# EAGLE board ellipticlock-display-r3 (EAGLE 5.12)
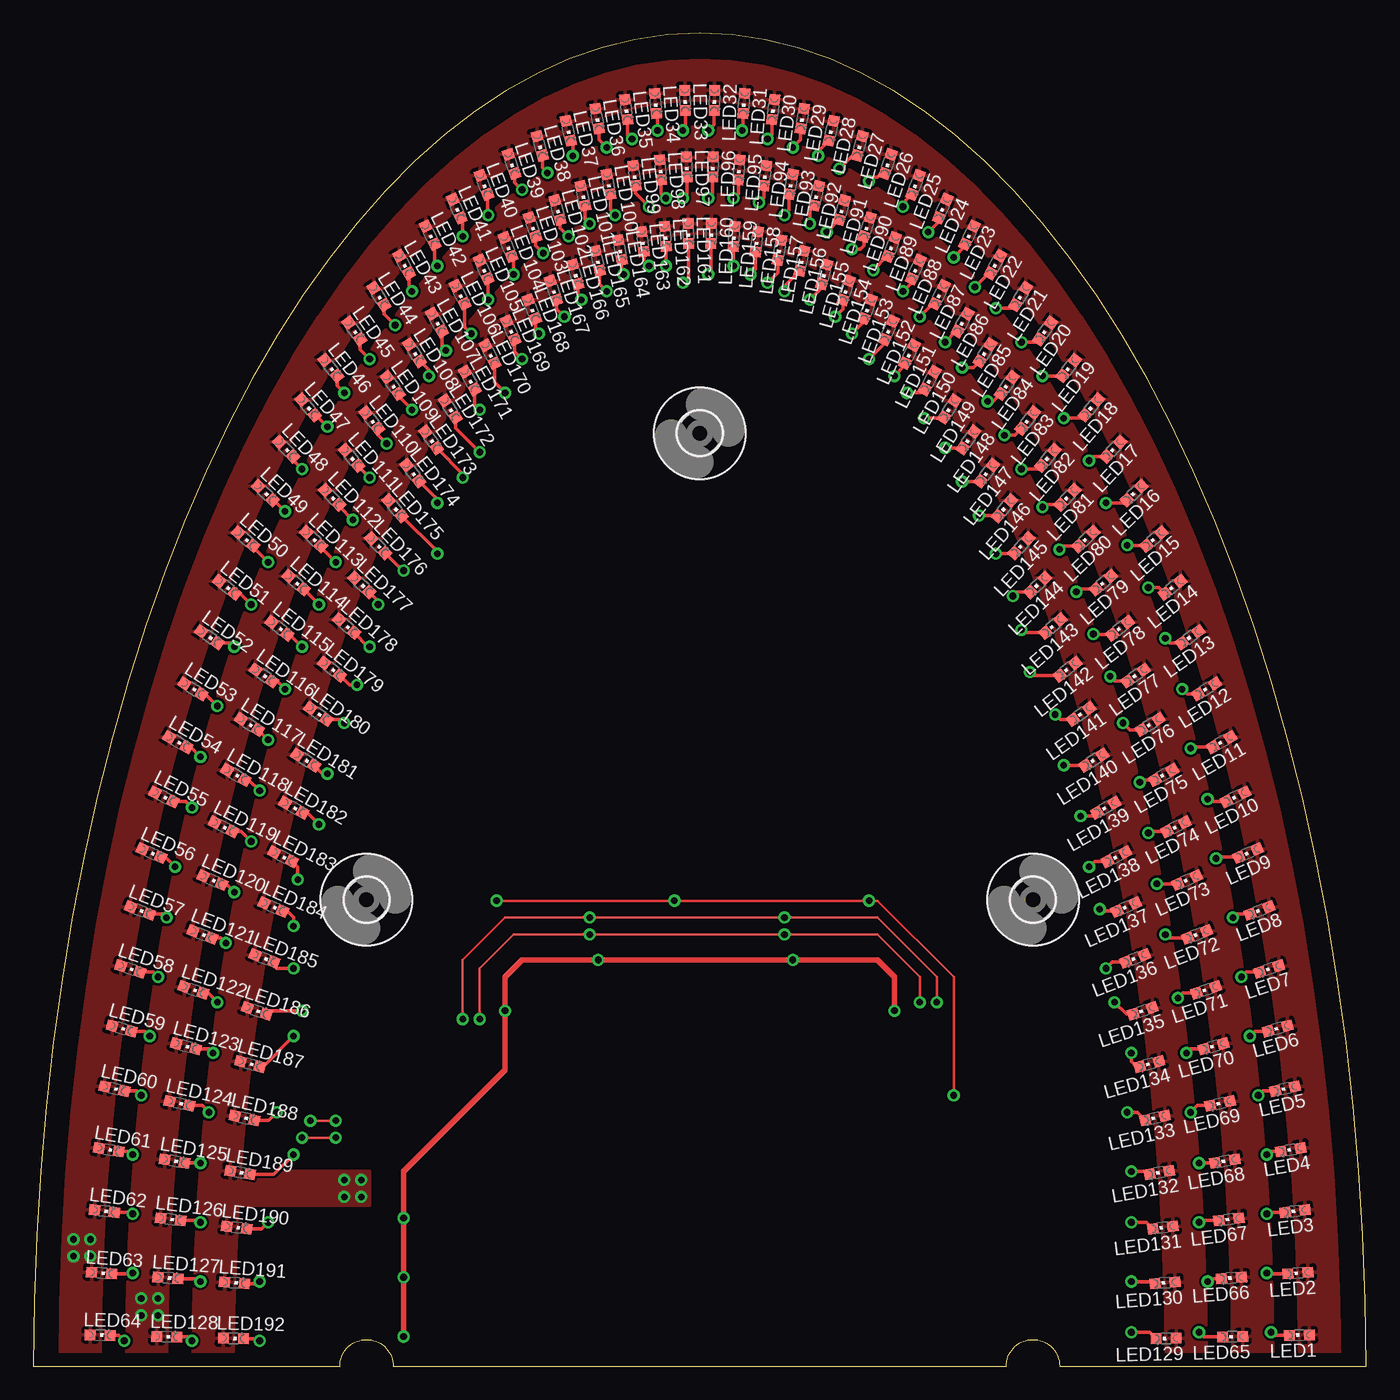
[diagram p5: board, top side]
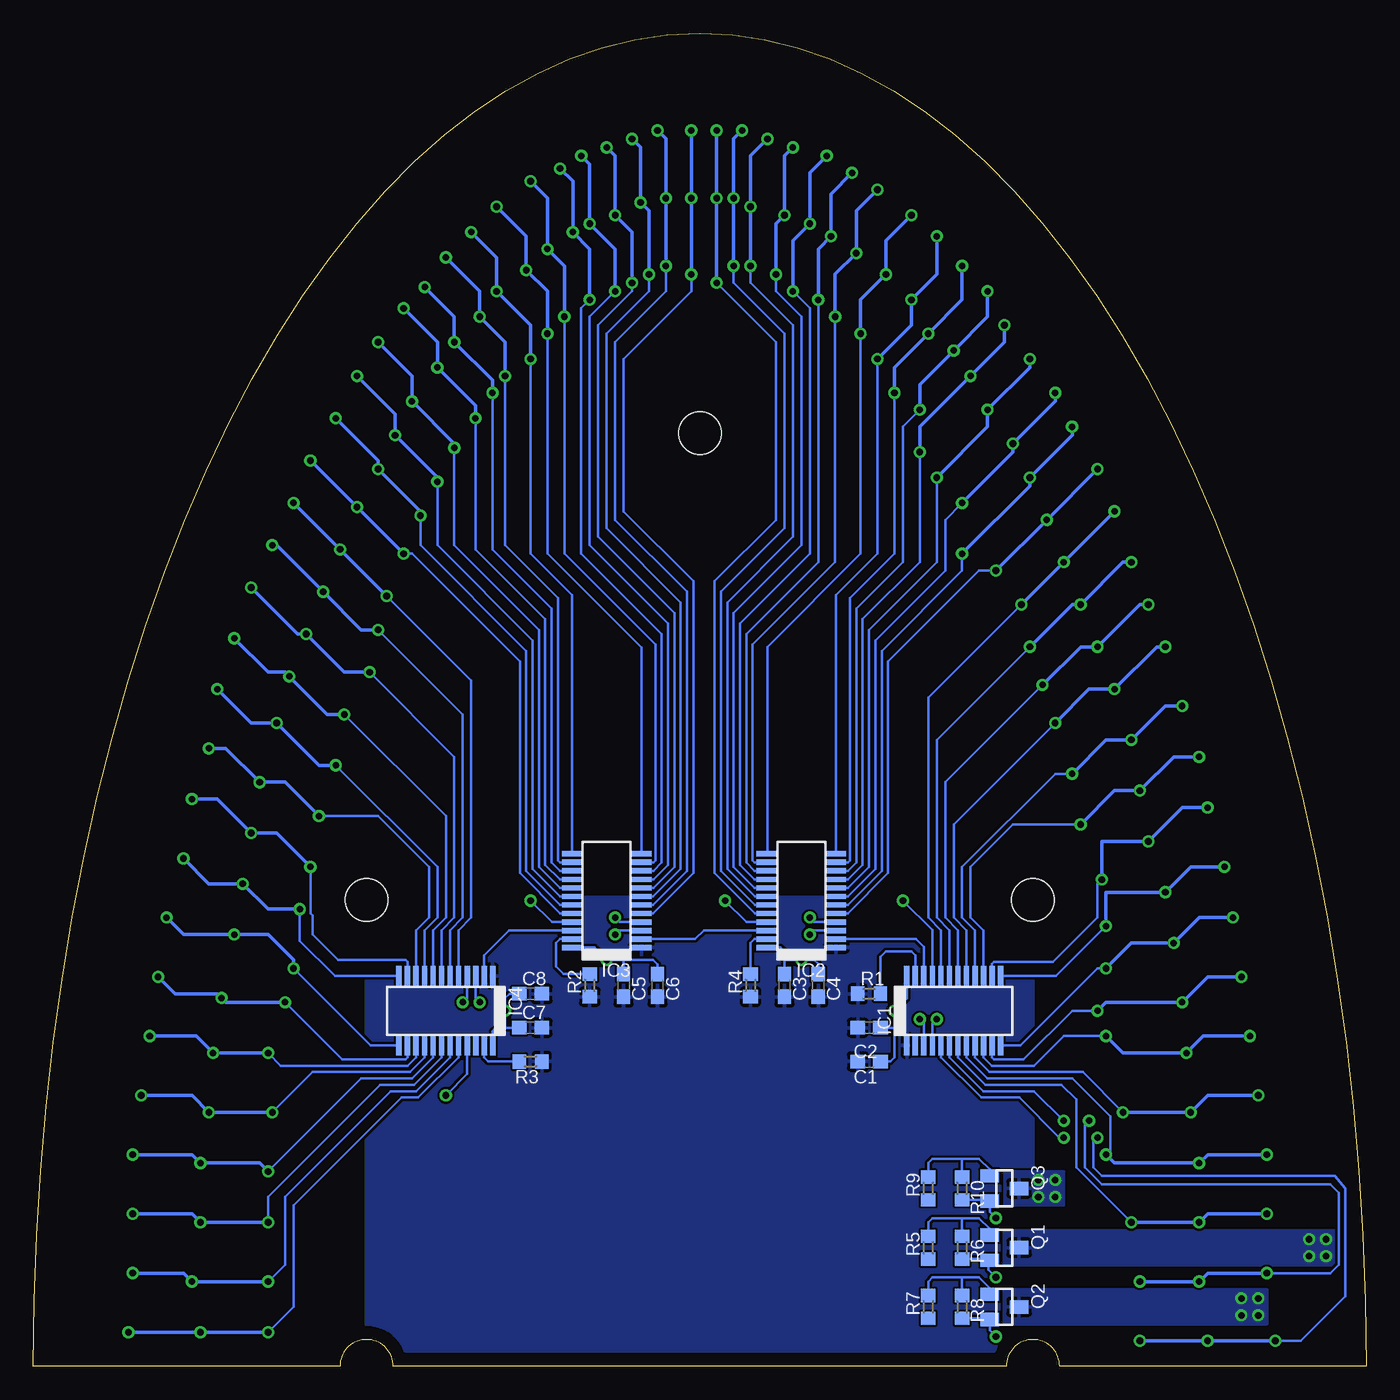
[diagram p6: board, bottom side, seen from below]

Size 100 x 100 mm. Coordinates in mm from the lower left corner, seen from the top.
Outline: 0,0 23,0 arc-90 25,2 arc-90 27,0 73,0 arc-90 75,2 arc-90 77,0 100,0 99.94,4.91 99.76,9.8 99.46,14.67 99.04,19.51 98.5,24.3 97.85,29.03 97.08,33.69 96.19,38.27 95.2,42.76 94.1,47.14 92.89,51.41 91.57,55.56 90.16,59.57 88.65,63.44 87.05,67.16 85.35,70.71 83.58,74.09 81.72,77.3 79.78,80.32 77.78,83.15 75.7,85.77 73.57,88.19 71.38,90.4 69.13,92.39 66.84,94.15 64.51,95.69 62.15,97 59.76,98.08 57.34,98.92 54.9,99.52 52.45,99.88 50,100 47.55,99.88 45.1,99.52 42.66,98.92 40.24,98.08 37.85,97 35.49,95.69 33.16,94.15 30.87,92.39 28.62,90.4 26.43,88.19 24.3,85.77 22.22,83.15 20.21,80.32 18.28,77.3 16.42,74.09 14.65,70.71 12.95,67.16 11.35,63.44 9.84,59.57 8.43,55.56 7.11,51.41 5.9,47.14 4.8,42.76 3.81,38.27 2.92,33.69 2.15,29.03 1.5,24.3 0.96,19.51 0.54,14.67 0.24,9.8 0.06,4.91 0,0
Copper layers (1*16): Top 0.035mm / dielectric 1.5mm / Bottom 0.035mm
Design rules "default *": minimum track width 6mil, minimum drill 0.5mm, track to track 7mil, track to pad 7mil, pad to pad 7mil, via to via 7mil, smd to smd 7mil, copper to edge 40mil, drill to drill 8mil, minimum pad ring 10mil, minimum via ring 8mil, stop-mask expansion 4mil, vias tented up to drill 20mil, thermal gap 10mil

## Footprints (pad centres in the part's own frame; a part is rotated, then mirrored left to right if it is on the bottom)
C0603 = smd 1.1 x 1: 1 -0.85,0; 2 0.85,0
3,2 = hole 3.2: 0,0
SSOP24-0.64 = smd 0.4 x 1.5: 1 -3.52,-2.6; 2 -2.88,-2.6; 3 -2.24,-2.6; 4 -1.6,-2.6; 5 -0.96,-2.6; 6 -0.32,-2.6; 7 0.32,-2.6; 8 0.96,-2.6; 9 1.6,-2.6; 10 2.24,-2.6; 11 2.88,-2.6; 12 3.52,-2.6; 13 3.52,2.6; 14 2.88,2.6; 15 2.24,2.6; 16 1.6,2.6; 17 0.96,2.6; 18 0.32,2.6; 19 -0.32,2.6; 20 -0.96,2.6; 21 -1.6,2.6; 22 -2.24,2.6; 23 -2.88,2.6; 24 -3.52,2.6
CHIPLED_0603 = smd 0.8 x 0.8: A 0,-0.75; C 0,0.75
SUPER-SOT3 = smd 1 x 1.4: 1 -0.95,-1.1; 2 0.95,-1.1; 3 0,1.1
R0603 = smd 1 x 1.1: 1 -0.85,0; 2 0.85,0

## Placement (x,y rotation side)
C1  100n  [C0603]  37.3,22.86 180 bottom
C2  1u  [C0603]  37.3,25.4 180 bottom
C3  100n  [C0603]  43.65,28.57 270 bottom
C4  1u  [C0603]  41.11,28.57 270 bottom
C5  100n  [C0603]  55.72,28.57 270 bottom
C6  1u  [C0603]  53.17,28.57 270 bottom
C7  100n  [C0603]  62.7,25.4 0 bottom
C8  1u  [C0603]  62.7,27.94 0 bottom
H1  MOUNT-HOLE3.2  [3,2]  25,35 0 top
H2  MOUNT-HOLE3.2  [3,2]  50,70 0 top
H3  MOUNT-HOLE3.2  [3,2]  75,35 0 top
IC1  TC62D748CFNAG  [SSOP24-0.64]  30.95,26.67 0 bottom
IC2  TC62D748CFNAG  [SSOP24-0.64]  42.38,34.92 90 bottom
IC3  TC62D748CFNAG  [SSOP24-0.64]  56.98,34.92 90 bottom
IC4  TC62D748CFNAG  [SSOP24-0.64]  69.05,26.67 180 bottom
LED1  [CHIPLED_0603]  94.99,2.33 91.4 top
LED2  [CHIPLED_0603]  94.88,6.99 94.2 top
LED3  [CHIPLED_0603]  94.66,11.63 97 top
LED4  [CHIPLED_0603]  94.34,16.24 99.8 top
LED5  [CHIPLED_0603]  93.91,20.81 102.7 top
LED6  [CHIPLED_0603]  93.37,25.34 105.5 top
LED7  [CHIPLED_0603]  92.73,29.8 108.3 top
LED8  [CHIPLED_0603]  91.98,34.19 111.1 top
LED9  [CHIPLED_0603]  91.14,38.5 113.9 top
LED10  [CHIPLED_0603]  90.2,42.71 116.7 top
LED11  [CHIPLED_0603]  89.15,46.83 119.5 top
LED12  [CHIPLED_0603]  88.02,50.82 122.3 top
LED13  [CHIPLED_0603]  86.79,54.7 125.2 top
LED14  [CHIPLED_0603]  85.48,58.45 128 top
LED15  [CHIPLED_0603]  84.07,62.05 130.8 top
LED16  [CHIPLED_0603]  82.59,65.51 133.6 top
LED17  [CHIPLED_0603]  81.03,68.8 136.4 top
LED18  [CHIPLED_0603]  79.39,71.93 139.2 top
LED19  [CHIPLED_0603]  77.69,74.89 142 top
LED20  [CHIPLED_0603]  75.91,77.67 144.8 top
LED21  [CHIPLED_0603]  74.07,80.26 147.7 top
LED22  [CHIPLED_0603]  72.18,82.66 150.5 top
LED23  [CHIPLED_0603]  70.23,84.86 153.3 top
LED24  [CHIPLED_0603]  68.24,86.85 156.1 top
LED25  [CHIPLED_0603]  66.2,88.63 158.9 top
LED26  [CHIPLED_0603]  64.12,90.21 161.7 top
LED27  [CHIPLED_0603]  62,91.56 164.5 top
LED28  [CHIPLED_0603]  59.86,92.69 167.3 top
LED29  [CHIPLED_0603]  57.69,93.6 170.2 top
LED30  [CHIPLED_0603]  55.51,94.29 173 top
LED31  [CHIPLED_0603]  53.31,94.74 175.8 top
LED32  [CHIPLED_0603]  51.1,94.97 178.6 top
LED33  [CHIPLED_0603]  48.9,94.97 181.4 top
LED34  [CHIPLED_0603]  46.69,94.74 184.2 top
LED35  [CHIPLED_0603]  44.49,94.29 187 top
LED36  [CHIPLED_0603]  42.31,93.6 189.8 top
LED37  [CHIPLED_0603]  40.14,92.69 192.7 top
LED38  [CHIPLED_0603]  38,91.56 195.5 top
LED39  [CHIPLED_0603]  35.88,90.21 198.3 top
LED40  [CHIPLED_0603]  33.8,88.63 201.1 top
LED41  [CHIPLED_0603]  31.76,86.85 203.9 top
LED42  [CHIPLED_0603]  29.77,84.86 206.7 top
LED43  [CHIPLED_0603]  27.82,82.66 209.5 top
LED44  [CHIPLED_0603]  25.93,80.26 212.3 top
LED45  [CHIPLED_0603]  24.09,77.67 215.2 top
LED46  [CHIPLED_0603]  22.31,74.89 218 top
LED47  [CHIPLED_0603]  20.61,71.93 220.8 top
LED48  [CHIPLED_0603]  18.97,68.8 223.6 top
LED49  [CHIPLED_0603]  17.41,65.51 226.4 top
LED50  [CHIPLED_0603]  15.93,62.05 229.2 top
LED51  [CHIPLED_0603]  14.52,58.45 232 top
LED52  [CHIPLED_0603]  13.21,54.7 234.8 top
LED53  [CHIPLED_0603]  11.98,50.82 237.7 top
LED54  [CHIPLED_0603]  10.85,46.83 240.5 top
LED55  [CHIPLED_0603]  9.8,42.71 243.3 top
LED56  [CHIPLED_0603]  8.86,38.5 246.1 top
LED57  [CHIPLED_0603]  8.02,34.19 248.9 top
LED58  [CHIPLED_0603]  7.27,29.8 251.7 top
LED59  [CHIPLED_0603]  6.63,25.34 254.5 top
LED60  [CHIPLED_0603]  6.09,20.81 257.3 top
LED61  [CHIPLED_0603]  5.66,16.24 260.2 top
LED62  [CHIPLED_0603]  5.34,11.63 263 top
LED63  [CHIPLED_0603]  5.12,6.99 265.8 top
LED64  [CHIPLED_0603]  5.01,2.33 268.6 top
LED65  [CHIPLED_0603]  89.99,2.21 91.4 top
LED66  [CHIPLED_0603]  89.89,6.62 94.2 top
LED67  [CHIPLED_0603]  89.7,11.02 97 top
LED68  [CHIPLED_0603]  89.41,15.39 99.8 top
LED69  [CHIPLED_0603]  89.03,19.72 102.7 top
LED70  [CHIPLED_0603]  88.55,24 105.5 top
LED71  [CHIPLED_0603]  87.98,28.23 108.3 top
LED72  [CHIPLED_0603]  87.32,32.39 111.1 top
LED73  [CHIPLED_0603]  86.57,36.47 113.9 top
LED74  [CHIPLED_0603]  85.73,40.47 116.7 top
LED75  [CHIPLED_0603]  84.8,44.36 119.5 top
LED76  [CHIPLED_0603]  83.79,48.15 122.3 top
LED77  [CHIPLED_0603]  82.7,51.82 125.2 top
LED78  [CHIPLED_0603]  81.53,55.37 128 top
LED79  [CHIPLED_0603]  80.29,58.79 130.8 top
LED80  [CHIPLED_0603]  78.97,62.06 133.6 top
LED81  [CHIPLED_0603]  77.58,65.18 136.4 top
LED82  [CHIPLED_0603]  76.13,68.15 139.2 top
LED83  [CHIPLED_0603]  74.61,70.95 142 top
LED84  [CHIPLED_0603]  73.03,73.58 144.8 top
LED85  [CHIPLED_0603]  71.4,76.04 147.7 top
LED86  [CHIPLED_0603]  69.72,78.31 150.5 top
LED87  [CHIPLED_0603]  67.98,80.39 153.3 top
LED88  [CHIPLED_0603]  66.21,82.28 156.1 top
LED89  [CHIPLED_0603]  64.4,83.97 158.9 top
LED90  [CHIPLED_0603]  62.55,85.46 161.7 top
LED91  [CHIPLED_0603]  60.67,86.74 164.5 top
LED92  [CHIPLED_0603]  58.76,87.81 167.3 top
LED93  [CHIPLED_0603]  56.84,88.67 170.2 top
LED94  [CHIPLED_0603]  54.9,89.32 173 top
LED95  [CHIPLED_0603]  52.94,89.76 175.8 top
LED96  [CHIPLED_0603]  50.98,89.97 178.6 top
LED97  [CHIPLED_0603]  49.02,89.97 181.4 top
LED98  [CHIPLED_0603]  47.06,89.76 184.2 top
LED99  [CHIPLED_0603]  45.1,89.32 187 top
LED100  [CHIPLED_0603]  43.16,88.67 189.8 top
LED101  [CHIPLED_0603]  41.24,87.81 192.7 top
LED102  [CHIPLED_0603]  39.33,86.74 195.5 top
LED103  [CHIPLED_0603]  37.45,85.46 198.3 top
LED104  [CHIPLED_0603]  35.6,83.97 201.1 top
LED105  [CHIPLED_0603]  33.79,82.28 203.9 top
LED106  [CHIPLED_0603]  32.02,80.39 206.7 top
LED107  [CHIPLED_0603]  30.28,78.31 209.5 top
LED108  [CHIPLED_0603]  28.6,76.04 212.3 top
LED109  [CHIPLED_0603]  26.97,73.58 215.2 top
LED110  [CHIPLED_0603]  25.39,70.95 218 top
LED111  [CHIPLED_0603]  23.87,68.15 220.8 top
LED112  [CHIPLED_0603]  22.42,65.18 223.6 top
LED113  [CHIPLED_0603]  21.03,62.06 226.4 top
LED114  [CHIPLED_0603]  19.71,58.79 229.2 top
LED115  [CHIPLED_0603]  18.47,55.37 232 top
LED116  [CHIPLED_0603]  17.3,51.82 234.8 top
LED117  [CHIPLED_0603]  16.21,48.15 237.7 top
LED118  [CHIPLED_0603]  15.2,44.36 240.5 top
LED119  [CHIPLED_0603]  14.27,40.47 243.3 top
LED120  [CHIPLED_0603]  13.43,36.47 246.1 top
LED121  [CHIPLED_0603]  12.68,32.39 248.9 top
LED122  [CHIPLED_0603]  12.02,28.23 251.7 top
LED123  [CHIPLED_0603]  11.45,24 254.5 top
LED124  [CHIPLED_0603]  10.97,19.72 257.3 top
LED125  [CHIPLED_0603]  10.59,15.39 260.2 top
LED126  [CHIPLED_0603]  10.3,11.02 263 top
LED127  [CHIPLED_0603]  10.11,6.62 265.8 top
LED128  [CHIPLED_0603]  10.01,2.21 268.6 top
LED129  [CHIPLED_0603]  84.99,2.09 91.4 top
LED130  [CHIPLED_0603]  84.91,6.25 94.2 top
LED131  [CHIPLED_0603]  84.74,10.4 97 top
LED132  [CHIPLED_0603]  84.48,14.53 99.8 top
LED133  [CHIPLED_0603]  84.15,18.62 102.7 top
LED134  [CHIPLED_0603]  83.73,22.67 105.5 top
LED135  [CHIPLED_0603]  83.23,26.66 108.3 top
LED136  [CHIPLED_0603]  82.65,30.59 111.1 top
LED137  [CHIPLED_0603]  82,34.45 113.9 top
LED138  [CHIPLED_0603]  81.26,38.22 116.7 top
LED139  [CHIPLED_0603]  80.45,41.9 119.5 top
LED140  [CHIPLED_0603]  79.57,45.47 122.3 top
LED141  [CHIPLED_0603]  78.62,48.94 125.2 top
LED142  [CHIPLED_0603]  77.59,52.29 128 top
LED143  [CHIPLED_0603]  76.5,55.52 130.8 top
LED144  [CHIPLED_0603]  75.35,58.61 133.6 top
LED145  [CHIPLED_0603]  74.13,61.56 136.4 top
LED146  [CHIPLED_0603]  72.86,64.36 139.2 top
LED147  [CHIPLED_0603]  71.53,67.01 142 top
LED148  [CHIPLED_0603]  70.15,69.49 144.8 top
LED149  [CHIPLED_0603]  68.72,71.81 147.7 top
LED150  [CHIPLED_0603]  67.25,73.96 150.5 top
LED151  [CHIPLED_0603]  65.74,75.92 153.3 top
LED152  [CHIPLED_0603]  64.18,77.71 156.1 top
LED153  [CHIPLED_0603]  62.6,79.3 158.9 top
LED154  [CHIPLED_0603]  60.98,80.71 161.7 top
LED155  [CHIPLED_0603]  59.33,81.92 164.5 top
LED156  [CHIPLED_0603]  57.67,82.93 167.3 top
LED157  [CHIPLED_0603]  55.98,83.75 170.2 top
LED158  [CHIPLED_0603]  54.28,84.36 173 top
LED159  [CHIPLED_0603]  52.57,84.77 175.8 top
LED160  [CHIPLED_0603]  50.86,84.97 178.6 top
LED161  [CHIPLED_0603]  49.14,84.97 181.4 top
LED162  [CHIPLED_0603]  47.43,84.77 184.2 top
LED163  [CHIPLED_0603]  45.72,84.36 187 top
LED164  [CHIPLED_0603]  44.02,83.75 189.8 top
LED165  [CHIPLED_0603]  42.33,82.93 192.7 top
LED166  [CHIPLED_0603]  40.67,81.92 195.5 top
LED167  [CHIPLED_0603]  39.02,80.71 198.3 top
LED168  [CHIPLED_0603]  37.4,79.3 201.1 top
LED169  [CHIPLED_0603]  35.82,77.71 203.9 top
LED170  [CHIPLED_0603]  34.26,75.92 206.7 top
LED171  [CHIPLED_0603]  32.75,73.96 209.5 top
LED172  [CHIPLED_0603]  31.28,71.81 212.3 top
LED173  [CHIPLED_0603]  29.85,69.49 215.2 top
LED174  [CHIPLED_0603]  28.47,67.01 218 top
LED175  [CHIPLED_0603]  27.14,64.36 220.8 top
LED176  [CHIPLED_0603]  25.87,61.56 223.6 top
LED177  [CHIPLED_0603]  24.65,58.61 226.4 top
LED178  [CHIPLED_0603]  23.5,55.52 229.2 top
LED179  [CHIPLED_0603]  22.41,52.29 232 top
LED180  [CHIPLED_0603]  21.38,48.94 234.8 top
LED181  [CHIPLED_0603]  20.43,45.47 237.7 top
LED182  [CHIPLED_0603]  19.55,41.9 240.5 top
LED183  [CHIPLED_0603]  18.74,38.22 243.3 top
LED184  [CHIPLED_0603]  18,34.45 246.1 top
LED185  [CHIPLED_0603]  17.35,30.59 248.9 top
LED186  [CHIPLED_0603]  16.77,26.66 251.7 top
LED187  [CHIPLED_0603]  16.27,22.67 254.5 top
LED188  [CHIPLED_0603]  15.85,18.62 257.3 top
LED189  [CHIPLED_0603]  15.52,14.53 260.2 top
LED190  [CHIPLED_0603]  15.26,10.4 263 top
LED191  [CHIPLED_0603]  15.09,6.25 265.8 top
LED192  [CHIPLED_0603]  15.01,2.09 268.6 top
Q1  FDN360P  [SUPER-SOT3]  27.14,8.89 270 bottom
Q2  FDN360P  [SUPER-SOT3]  27.14,4.45 270 bottom
Q3  FDN360P  [SUPER-SOT3]  27.14,13.34 270 bottom
R1  [R0603]  37.3,27.94 0 bottom
R2  [R0603]  58.26,28.57 90 bottom
R3  [R0603]  62.7,22.86 180 bottom
R4  [R0603]  46.19,28.57 90 bottom
R5  1K  [R0603]  32.86,8.89 90 bottom
R6  10K  [R0603]  30.32,8.89 270 bottom
R7  1K  [R0603]  32.86,4.45 90 bottom
R8  10K  [R0603]  30.32,4.45 270 bottom
R9  1K  [R0603]  32.86,13.34 90 bottom
R10  10K  [R0603]  30.32,13.34 270 bottom

## Tracks (layer width: path | path; a pad name or v marks a point on that pad's centre or on a via)
+5V  (via drill 0.5)
  Top 0.406: v64.61,26.67 64.61,29.21 63.34,30.48 v56.98,30.48 v42.38,30.48 36.66,30.48 35.39,29.21 v35.39,26.67 35.39,22.23 27.77,14.61 v27.77,11.11 v27.77,6.67 v27.77,2.22
  Bottom 0.203: 35.39,25.4 35.39,23.18 35.71,22.86 C1.1 | 35.39,25.4 C2.1 | IC2.24 43.94,31.41 43.65,31.11 43.65,30.48 | 43.65,30.48 C3.1 | C4.1 41.11,30.16 41.43,30.48 v42.38,30.48 | v42.38,30.48 43.65,30.48 | 55.72,30.48 53.49,30.48 53.17,30.16 C6.1 | 55.72,30.48 C5.1 | IC4.24 65.53,25.11 65.24,25.4 64.61,25.4 | 64.61,25.4 C7.1 | C8.1 64.29,27.94 64.61,27.62 v64.61,26.67 64.61,25.4 | IC3.24 57.91,31.41 v56.98,30.48 55.72,30.48 | v42.38,30.48 | 35.39,25.4 v35.39,26.67 34.47,27.59 IC1.24 | R10.2 28.34,12.48 Q3.2 28.24,11.58 v27.77,11.11 | 28.34,8.04 R6.2 | 28.34,8.04 Q1.2 | R8.2 28.34,3.6 Q2.2 28.24,2.69 v27.77,2.22 | 28.34,8.04 28.34,7.23 v27.77,6.67
GND
  pour Bottom (rank 6): 25,0 25,35.16 75,35.16 75,0
LAT  (via drill 0.5)
  Top 0.203: v67.78,27.3 67.78,29.21 63.34,33.66 v56.35,33.66 v41.74,33.66 35.39,33.66 32.22,30.48 v32.22,26.04
  Bottom 0.203: IC4.4 67.45,27.64 v67.78,27.3 | v56.35,33.66 56.02,33.33 IC3.4 | IC2.4 41.41,33.33 v41.74,33.66 | IC1.4 32.55,25.7 v32.22,26.04
N$1
  Bottom 0.203: IC2.2 33.78,32.05 33.19,31.45 IC1.22
N$6
  Bottom 0.203: IC4.2 66.17,30.82 64.31,32.69 IC3.22
N$7
  Bottom 0.203: IC3.2 50.34,32.05 49.7,32.69 IC2.22
N$8
  Bottom 0.203: IC2.23 45.89,32.05 46.19,31.75 R4.2
N$9
  Bottom 0.203: IC4.23 66.17,23.16 65.88,22.86 R3.2
N$10
  Bottom 0.203: IC1.23 33.83,30.82 34.12,31.11 36.03,31.11 36.45,30.7 R1.2
N$11
  Bottom 0.203: IC3.23 60.5,32.05 60.8,31.75 60.8,30 60.22,29.43 R2.2
N$12
  Bottom 0.203: 30.32,11.11 32.54,11.11 32.86,10.79 R5.2 | 30.32,11.11 R6.1 | Q1.1 28.24,10.31 29.05,11.11 30.32,11.11
N$28
  Bottom 0.203: 30.32,6.67 32.54,6.67 32.86,6.35 R7.2 | 30.32,6.67 R8.1 | Q2.1 28.24,5.86 29.05,6.67 30.32,6.67
N$29
  Bottom 0.203: 30.32,15.56 32.54,15.56 32.86,15.24 R9.2 | 30.32,15.56 R10.1 | Q3.1 28.24,14.75 29.05,15.56 30.32,15.56
OE  (via drill 0.5)
  Top 0.203: v34.76,34.92 v48.09,34.92 v62.7,34.92 63.34,34.92 69.05,29.21 v69.05,20.32
  Bottom 0.203: IC2.21 46.49,33.33 v48.09,34.92 | v34.76,34.92 32.55,32.72 IC1.21 | IC3.21 61.1,33.33 v62.7,34.92 | IC4.21 67.45,21.92 v69.05,20.32
RING1  (via drill 0.5)
  other vias: 3.01,9.53 4.28,9.53 4.28,8.26 3.01,8.26
  pour Top: 95,0 94.95,4.66 94.78,9.31 94.51,13.94 94.14,18.53 93.65,23.08 93.06,27.58 92.37,32 91.57,36.35 90.68,40.62 89.69,44.78 88.6,48.84 87.42,52.78 86.14,56.59 84.79,60.27 83.34,63.8 81.82,67.18 80.22,70.39 78.55,73.44 76.81,76.3 75,78.99 73.13,81.48 71.21,83.78 69.24,85.88 67.22,87.77 65.16,89.45 63.06,90.91 60.93,92.15 58.78,93.17 56.6,93.97 54.41,94.54 52.21,94.89 50,95 47.79,94.89 45.59,94.54 43.4,93.97 41.22,93.17 39.07,92.15 36.94,90.91 34.84,89.45 32.78,87.77 30.76,85.88 28.79,83.78 26.87,81.48 25,78.99 23.19,76.3 21.45,73.44 19.78,70.39 18.18,67.18 16.66,63.8 15.21,60.27 13.86,56.59 12.58,52.78 11.4,48.84 10.31,44.78 9.32,40.62 8.43,36.35 7.63,32 6.94,27.58 6.35,23.08 5.86,18.53 5.49,13.94 5.22,9.31 5.05,4.66 5,0 2,0 2.06,4.81 2.23,9.61 2.52,14.38 2.92,19.12 3.44,23.81 4.07,28.45 4.81,33.02 5.65,37.5 6.61,41.9 7.67,46.2 8.83,50.38 10.09,54.45 11.45,58.38 12.9,62.17 14.43,65.81 16.06,69.3 17.77,72.61 19.55,75.75 21.41,78.71 23.33,81.48 25.32,84.06 27.37,86.43 29.48,88.59 31.63,90.54 33.83,92.27 36.07,93.78 38.34,95.06 40.64,96.12 42.96,96.94 45.3,97.53 47.64,97.88 50,98 52.36,97.88 54.7,97.53 57.04,96.94 59.36,96.12 61.66,95.06 63.93,93.78 66.17,92.27 68.37,90.54 70.52,88.59 72.63,86.43 74.68,84.06 76.67,81.48 78.59,78.71 80.45,75.75 82.23,72.61 83.94,69.3 85.57,65.81 87.1,62.17 88.55,58.38 89.91,54.45 91.17,50.38 92.33,46.2 93.39,41.9 94.35,37.5 95.19,33.02 95.93,28.45 96.56,23.81 97.08,19.12 97.48,14.38 97.77,9.61 97.94,4.81 98,0
  pour Bottom: 27.14,7.62 27.14,10.16 2.38,10.16 2.38,7.62
RING2  (via drill 0.5)
  other vias: 8.09,5.08 9.36,5.08 9.36,3.81 8.09,3.81
  pour Top: 90,0 89.95,4.42 89.81,8.82 89.57,13.21 89.23,17.56 88.8,21.87 88.28,26.13 87.66,30.32 86.96,34.44 86.16,38.48 85.28,42.43 84.31,46.27 83.26,50 82.13,53.61 80.92,57.1 79.64,60.44 78.28,63.64 76.86,66.69 75.38,69.57 73.83,72.29 72.22,74.83 70.56,77.2 68.86,79.37 67.1,81.36 65.31,83.15 63.48,84.74 61.61,86.12 59.72,87.3 57.8,88.27 55.87,89.03 53.92,89.57 51.96,89.89 50,90 48.04,89.89 46.08,89.57 44.13,89.03 42.2,88.27 40.28,87.3 38.39,86.12 36.52,84.74 34.69,83.15 32.9,81.36 31.14,79.37 29.44,77.2 27.78,74.83 26.17,72.29 24.62,69.57 23.14,66.69 21.72,63.64 20.36,60.44 19.08,57.1 17.87,53.61 16.74,50 15.69,46.27 14.72,42.43 13.84,38.48 13.04,34.44 12.34,30.32 11.72,26.13 11.2,21.87 10.77,17.56 10.43,13.21 10.19,8.82 10.05,4.42 10,0 7,0 7.05,4.56 7.21,9.12 7.47,13.65 7.83,18.14 8.29,22.6 8.85,27 9.51,31.33 10.27,35.59 11.13,39.76 12.08,43.84 13.12,47.81 14.25,51.67 15.46,55.4 16.76,59 18.14,62.45 19.59,65.76 21.12,68.91 22.72,71.89 24.38,74.7 26.11,77.33 27.89,79.77 29.73,82.02 31.62,84.07 33.54,85.92 35.51,87.56 37.52,89 39.55,90.21 41.61,91.21 43.69,91.99 45.79,92.55 47.89,92.89 50,93 52.11,92.89 54.21,92.55 56.31,91.99 58.39,91.21 60.45,90.21 62.48,89 64.49,87.56 66.46,85.92 68.38,84.07 70.27,82.02 72.11,79.77 73.89,77.33 75.62,74.7 77.28,71.89 78.88,68.91 80.41,65.76 81.86,62.45 83.24,59 84.54,55.4 85.75,51.67 86.88,47.81 87.92,43.84 88.87,39.76 89.73,35.59 90.49,31.33 91.15,27 91.71,22.6 92.17,18.14 92.53,13.65 92.79,9.12 92.95,4.56 93,0
  pour Bottom: 7.45,3.17 27.14,3.17 27.14,5.71 7.45,5.71
RING3  (via drill 0.5)
  other vias: 23.33,13.97 23.33,12.7 24.6,12.7 24.6,13.97
  pour Top: 85,0 84.96,4.17 84.83,8.33 84.62,12.47 84.33,16.58 83.95,20.65 83.49,24.67 82.95,28.64 82.34,32.53 81.64,36.34 80.87,40.07 80.02,43.7 79.1,47.22 78.11,50.63 77.06,53.92 75.93,57.08 74.75,60.1 73.5,62.98 72.2,65.71 70.85,68.27 69.44,70.67 67.99,72.91 66.5,74.96 64.96,76.84 63.39,78.53 61.79,80.03 60.16,81.34 58.5,82.45 56.83,83.37 55.14,84.08 53.43,84.59 51.72,84.9 50,85 48.28,84.9 46.57,84.59 44.86,84.08 43.17,83.37 41.5,82.45 39.84,81.34 38.21,80.03 36.61,78.53 35.04,76.84 33.5,74.96 32.01,72.91 30.55,70.67 29.15,68.27 27.8,65.71 26.5,62.98 25.25,60.1 24.07,57.08 22.94,53.92 21.89,50.63 20.9,47.22 19.98,43.7 19.13,40.07 18.36,36.34 17.66,32.53 17.05,28.64 16.51,24.67 16.05,20.65 15.67,16.58 15.38,12.47 15.17,8.33 15.04,4.17 15,0 12,0 12.05,4.32 12.18,8.63 12.41,12.91 12.73,17.17 13.14,21.38 13.64,25.55 14.22,29.65 14.89,33.68 15.65,37.62 16.49,41.48 17.41,45.24 18.4,48.89 19.48,52.42 20.63,55.83 21.84,59.1 23.13,62.23 24.48,65.2 25.89,68.02 27.36,70.68 28.89,73.17 30.46,75.48 32.09,77.61 33.75,79.55 35.46,81.3 37.2,82.86 38.97,84.21 40.77,85.36 42.59,86.31 44.42,87.05 46.28,87.58 48.14,87.89 50,88 51.86,87.89 53.72,87.58 55.58,87.05 57.41,86.31 59.23,85.36 61.03,84.21 62.8,82.86 64.54,81.3 66.25,79.55 67.91,77.61 69.54,75.48 71.11,73.17 72.64,70.68 74.11,68.02 75.52,65.2 76.87,62.23 78.16,59.1 79.37,55.83 80.52,52.42 81.6,48.89 82.59,45.24 83.51,41.48 84.35,37.62 85.11,33.68 85.78,29.65 86.36,25.55 86.86,21.38 87.27,17.17 87.59,12.91 87.82,8.63 87.95,4.32 88,0
  pour Top: 25.23,12.06 25.23,14.61 15.08,14.61 15.08,12.06
  pour Bottom: 27.14,14.61 27.14,12.06 22.7,12.06 22.7,14.61
SCK  (via drill 0.5)
  Top 0.203: v33.49,26.04 33.49,29.84 36.03,32.38 v41.74,32.38 v56.35,32.38 63.34,32.38 66.51,29.21 v66.51,27.3
  Bottom 0.203: IC1.3 33.19,25.73 v33.49,26.04 | v56.35,32.38 56.05,32.69 IC3.3 | IC2.3 41.45,32.69 v41.74,32.38 | IC4.3 66.81,27.61 v66.51,27.3
SPOKE1  (via drill 0.5)
  Top 0.254: v82.38,2.54 83.77,2.54 LED129.C | LED1.C 93.09,2.31 v92.86,2.54 | LED65.C 87.81,2.19 v87.47,2.54
  Bottom 0.203: IC4.20 68.09,23.18 71.11,20.16 72.38,20.16 80.48,12.06 80.48,4.45 v82.38,2.54
  Bottom 0.254: v82.38,2.54 v87.47,2.54 v92.86,2.54
SPOKE2  (via drill 0.5)
  Top 0.254: v82.38,6.35 84,6.35 LED130.C | LED66.C 88.32,6.57 v88.1,6.35 | LED2.C 92.6,6.93 v92.55,6.99
  Bottom 0.203: IC4.19 68.73,23.18 71.27,20.64 73.18,20.64 81.11,12.7 81.11,7.62 v82.38,6.35
  Bottom 0.254: v82.38,6.35 v88.1,6.35 88.73,6.99 v92.55,6.99
SPOKE3  (via drill 0.5)
  Top 0.254: v82.38,10.79 83.51,10.79 LED131.C | LED67.C 87.6,10.93 v87.47,10.79 | LED3.C 92.65,11.54 v92.55,11.43
  Bottom 0.203: IC4.18 69.37,23.18 71.43,21.11 73.97,21.11 82.38,12.7 v82.38,10.79
  Bottom 0.254: v82.38,10.79 v87.47,10.79 88.1,11.43 v92.55,11.43
SPOKE4  (via drill 0.5)
  Top 0.254: v82.38,14.61 83.55,14.61 LED132.C | LED4.C 92.78,16.11 v92.55,15.88 | LED68.C 87.48,15.26 v87.47,15.24
  Bottom 0.203: IC4.17 70.01,23.17 71.59,21.59 75.4,21.59 v82.38,14.61
  Bottom 0.254: v92.55,15.88 88.1,15.88 v87.47,15.24 83.02,15.24 v82.38,14.61
SPOKE5  (via drill 0.5)
  Top 0.254: v82.07,19.05 82.83,19.05 LED133.C | LED69.C 87.33,19.55 v86.83,19.05 | LED5.C 92.24,20.65 v91.91,20.32
  Bottom 0.203: IC4.16 70.65,23.16 71.75,22.07 79.05,22.07 v82.07,19.05
  Bottom 0.254: v82.07,19.05 v86.83,19.05 88.1,20.32 v91.91,20.32
SPOKE6  (via drill 0.5)
  Top 0.254: LED6.C 91.65,25.14 v91.28,24.77 | LED70.C 86.82,23.8 v86.51,23.5 | LED134.C 82.78,22.47 82.38,22.86 v82.38,23.5
  Bottom 0.203: IC4.15 71.29,23.16 71.91,22.54 81.43,22.54 v82.38,23.5
  Bottom 0.254: v91.28,24.77 87.78,24.77 v86.51,23.5 v82.38,23.5
SPOKE7  (via drill 0.5)
  Top 0.254: LED7.C 90.99,29.56 v90.64,29.21 | LED71.C 86.25,28 v85.88,27.62 | LED135.C 81.99,26.43 v81.11,27.3
  Bottom 0.203: IC4.14 71.93,23.16 72.07,23.02 76.83,23.02 v81.11,27.3
  Bottom 0.254: v81.11,27.3 85.56,27.3 v85.88,27.62 86.19,27.94 89.37,27.94 v90.64,29.21
SPOKE8  (via drill 0.5)
  Top 0.254: LED8.C 90.27,33.92 v90,33.66 | LED72.C 85.19,32.12 v84.92,32.38 | LED136.C 80.96,30.32 v80.48,29.84
  Bottom 0.203: IC4.13 74.7,24.07 v80.48,29.84
  Bottom 0.254: v90,33.66 88.73,32.38 v84.92,32.38 82.38,32.38 80.48,30.48 v80.48,29.84
SPOKE9  (via drill 0.5)
  Top 0.254: LED9.C 88.83,38.19 v88.73,38.1 | LED137.C 80.15,34.14 v80,34.29 | LED73.C 84.32,36.17 v84.29,36.2
  Bottom 0.203: IC4.12 77.36,29.27 80,31.91 v80,34.29
  Bottom 0.254: v80,34.29 82.38,34.29 v84.29,36.2 86.83,36.2 v88.73,38.1
SPOKE10  (via drill 0.5)
  Top 0.254: LED74.C 83.78,40.13 v83.66,40.01 | LED10.C 88.27,42.38 v88.1,42.55 | LED138.C 79.62,37.88 v79.21,37.47
  Bottom 0.203: IC4.11 71.93,30.34 72.07,30.48 77.15,30.48 79.05,32.38 79.05,33.81 79.21,33.97 v79.21,37.47
  Bottom 0.254: v79.21,37.47 81.75,40.01 v83.66,40.01 86.19,42.55 v88.1,42.55
SPOKE11  (via drill 0.5)
  Top 0.254: v78.58,41.27 79.55,41.27 LED139.C | LED75.C 83.2,43.99 v83.02,43.81 | LED11.C 86.93,46.46 v86.83,46.35
  Bottom 0.203: IC4.10 71.29,32.69 70.32,33.66 70.32,37.47 74.13,41.27 v78.58,41.27
  Bottom 0.254: v78.58,41.27 81.11,43.81 v83.02,43.81 85.56,46.35 v86.83,46.35
SPOKE12  (via drill 0.5)
  Top 0.254: LED12.C 86.57,50.42 v86.19,50.8 | LED140.C 77.32,45.07 v77.31,45.09 | LED76.C 82.26,47.75 v81.75,48.26
  Bottom 0.203: IC4.9 70.65,32.69 69.69,33.66 69.69,37.47 v77.31,45.09
  Bottom 0.254: v77.31,45.09 78.58,45.09 v81.75,48.26 83.66,48.26 v86.19,50.8
SPOKE13  (via drill 0.5)
  Top 0.254: LED13.C 85.27,54.27 v84.92,54.61 | LED77.C 81.16,51.39 v80.8,51.75 | LED141.C 77.05,48.51 v76.67,48.9
  Bottom 0.203: IC4.8 70.01,32.7 69.05,33.66 69.05,41.27 v76.67,48.9
  Bottom 0.254: v76.67,48.9 77.94,48.9 v80.8,51.75 81.11,52.07 82.38,52.07 v84.92,54.61
SPOKE14  (via drill 0.5)
  Top 0.254: v83.66,58.42 84.45,58.42 LED14.C | LED142.C 75,51.83 v74.77,52.07 | LED78.C 79.55,54.91 v79.53,54.93
  Bottom 0.203: IC4.7 69.37,32.7 68.41,33.66 68.41,45.72 v74.77,52.07
  Bottom 0.254: v74.77,52.07 76.67,52.07 v79.53,54.93 80.16,54.93 v83.66,58.42
SPOKE15  (via drill 0.5)
  Top 0.254: LED143.C 74.34,55.03 v74.13,55.24 | LED15.C 82.1,61.56 v82.07,61.59 | LED79.C 78.45,58.3 v78.26,58.1
  Bottom 0.203: IC4.6 68.73,32.7 67.78,33.66 67.78,48.9 v74.13,55.24
  Bottom 0.254: v74.13,55.24 75.4,55.24 v78.26,58.1 81.75,61.59 v82.07,61.59
SPOKE16  (via drill 0.5)
  Top 0.254: v80.48,64.77 81.83,64.77 LED16.C | LED80.C 77.25,61.54 v76.99,61.28 | LED144.C 73.8,58.09 v73.5,57.78
  Bottom 0.203: IC4.5 68.09,32.71 67.14,33.66 67.14,51.44 v73.5,57.78
  Bottom 0.254: v73.5,57.78 v76.99,61.28 v80.48,64.77
SPOKE17  (via drill 0.5)
  Top 0.254: LED145.C 73.56,60.96 v72.22,60.96 | LED17.C 79.53,68.26 v79.21,67.94 | LED81.C 75.9,64.64 v75.72,64.45
  Bottom 0.203: IC3.20 60.47,33.97 63.49,36.99 63.49,52.86 71.59,60.96 v72.22,60.96
  Bottom 0.254: v72.22,60.96 v75.72,64.45 v79.21,67.94
SPOKE18  (via drill 0.5)
  Top 0.254: LED146.C 72.35,63.82 v70.95,63.82 | LED18.C 78.66,71.12 v77.31,71.12 | LED82.C 75.37,67.31 v74.13,67.31
  Bottom 0.203: IC3.19 60.48,34.6 63.02,37.15 63.02,53.66 70.95,61.59 v70.95,63.82
  Bottom 0.254: v77.31,71.12 74.13,67.94 v74.13,67.31 70.95,64.14 v70.95,63.82
SPOKE19  (via drill 0.5)
  Top 0.254: LED147.C 71.01,66.36 v69.69,66.36 | LED19.C v75.72,74.3 | LED83.C 73.64,69.85 v72.86,69.85
  Bottom 0.203: IC3.18 60.48,35.24 62.54,37.31 62.54,54.45 69.69,61.59 v69.69,66.36
  Bottom 0.254: 69.69,66.04 v69.69,66.36 69.69,66.67 v72.86,69.85 72.86,71.44 v75.72,74.3
SPOKE20  (via drill 0.5)
  Top 0.254: LED148.C 69.7,68.9 v68.41,68.9 | LED20.C 75.26,76.83 v74.13,76.83 | LED84.C 72.02,72.39 v71.59,72.39
  Bottom 0.203: IC3.17 60.48,35.88 62.06,37.47 62.06,55.24 68.41,61.59 v68.41,68.9
  Bottom 0.254: v74.13,76.83 71.59,74.3 v71.59,72.39 68.41,69.22 v68.41,68.9
SPOKE21  (via drill 0.5)
  Top 0.254: LED149.C 68.27,71.12 v66.83,71.12 | LED21.C 73.42,79.38 v72.22,79.38 | LED85.C 70.53,74.93 v69.69,74.93
  Bottom 0.203: IC3.16 60.49,36.52 61.59,37.62 61.59,56.04 66.83,61.28 v66.83,71.12
  Bottom 0.254: v72.22,79.38 69.69,76.83 v69.69,74.93 66.83,72.07 v66.83,71.12
SPOKE22  (via drill 0.5)
  Top 0.254: LED22.C 71.68,82 v70.64,80.96 | LED86.C 69.23,77.66 v68.41,76.83 | LED150.C 66.6,73.03 v65.56,73.03
  Bottom 0.203: IC3.15 60.49,37.16 61.11,37.78 61.11,56.83 65.56,61.28 v65.56,73.03
  Bottom 0.254: v65.56,73.03 65.56,73.98 v68.41,76.83 68.41,78.74 v70.64,80.96
SPOKE23  (via drill 0.5)
  Top 0.254: LED23.C 69.89,84.03 v69.05,83.19 | LED87.C 67.49,79.72 v66.51,78.74 | LED151.C 65.4,75.09 v64.61,74.3
  Bottom 0.203: IC3.14 60.5,37.8 60.64,37.94 60.64,57.63 64.61,61.59 v64.61,74.3
  Bottom 0.254: v64.61,74.3 64.61,76.83 v66.51,78.74 66.51,80.64 v69.05,83.19
SPOKE24  (via drill 0.5)
  Top 0.254: LED24.C 67.93,85.88 v67.14,85.09 | LED88.C 65.91,81.31 v65.24,80.64 | LED152.C 63.88,76.75 v62.7,75.56
  Bottom 0.203: IC3.13 59.59,57.84 62.7,60.96 v62.7,75.56
  Bottom 0.254: v62.7,75.56 62.7,78.11 v65.24,80.64 65.24,83.19 v67.14,85.09
SPOKE25  (via drill 0.5)
  Top 0.254: v65.24,87 65.24,87.25 LED25.C | LED89.C 64.06,83.27 v63.02,82.23 | LED153.C 62.33,78.37 v61.43,77.47
  Bottom 0.203: IC3.12 54.38,53.91 61.43,60.96 v61.43,77.47
  Bottom 0.254: v61.43,77.47 61.43,80.64 v63.02,82.23 63.02,84.77 v65.24,87
SPOKE26  (via drill 0.5)
  Top 0.254: v62.7,88.9 63.02,89.22 63.34,89.22 63.61,89.49 LED26.C | LED90.C 62.31,84.07 62.06,83.82 v61.43,83.82 | LED154.C 60.74,79.32 v60.16,78.74
  Bottom 0.203: IC3.11 53.47,37.8 53.33,37.94 53.33,54.13 60.16,60.96 v60.16,78.74
  Bottom 0.254: v60.16,78.74 60.16,82.55 v61.43,83.82 61.43,87.63 v62.7,88.9
SPOKE27  (via drill 0.5)
  Top 0.254: v60.48,89.85 61.46,90.84 LED27.C | LED91.C 60.45,86.02 v59.52,85.09 | LED155.C 59.13,80.89 v58.26,80.01
  Bottom 0.203: v58.26,80.01 58.89,79.38 58.89,60.96 52.86,54.93 52.86,37.78 53.48,37.16 IC3.10
  Bottom 0.254: v58.26,80.01 58.26,83.82 v59.52,85.09 59.52,88.9 v60.48,89.85
SPOKE28  (via drill 0.5)
  Top 0.254: LED156.C 56.35,81.05 v56.35,80.64 | LED92.C 58.26,86.74 v58.26,85.72 | LED28.C 58.89,91.16 v58.89,90.81
  Bottom 0.203: IC3.9 53.48,36.52 52.38,37.62 52.38,55.72 58.26,61.59 58.26,78.74 v56.35,80.64
  Bottom 0.254: v56.35,80.64 56.35,83.82 v58.26,85.72 58.26,90.17 v58.89,90.81
SPOKE29  (via drill 0.5)
  Top 0.254: LED29.C 57.57,92.02 v56.98,91.44 | LED93.C 56.71,86.72 v56.35,86.36 | LED157.C 55.86,82.06 v55.08,81.28
  Bottom 0.203: IC3.8 53.48,35.88 51.91,37.47 51.91,56.52 57.62,62.23 57.62,78.11 55.08,80.64 v55.08,81.28
  Bottom 0.254: v55.08,81.28 55.08,85.09 v56.35,86.36 56.35,90.81 v56.98,91.44
SPOKE30  (via drill 0.5)
  Top 0.254: LED30.C 55.42,92.41 v55.08,92.08 | LED94.C 54.8,87.67 v54.45,87.31 | LED158.C 54.19,82.3 v53.81,81.92
  Bottom 0.203: IC3.7 53.49,35.24 51.43,37.31 51.43,57.31 56.98,62.87 56.98,77.47 53.81,80.64 v53.81,81.92
  Bottom 0.254: v53.81,81.92 53.81,86.68 v54.45,87.31 54.45,91.44 v55.08,92.08
SPOKE31  (via drill 0.5)
  Top 0.254: LED31.C 53.26,92.79 v53.17,92.71 | LED95.C 52.89,87.98 v52.54,87.63 | LED159.C 52.52,82.57 v52.54,82.55
  Bottom 0.203: IC3.6 53.49,34.6 50.95,37.15 50.95,58.1 56.35,63.5 56.35,76.83 52.54,80.64 v52.54,82.55
  Bottom 0.254: v52.54,82.55 v52.54,87.63 52.54,92.08 v53.17,92.71
SPOKE32  (via drill 0.5)
  Top 0.254: LED32.C 51.09,93.16 v50.63,92.71 | LED96.C 50.96,87.96 v50.63,87.63 | LED160.C 50.84,82.12 v50.63,81.92
  Bottom 0.203: IC3.5 53.5,33.97 50.48,36.99 50.48,39.53 50.48,58.9 55.72,64.14 55.72,75.56 50.63,80.64 v50.63,81.92
  Bottom 0.254: v50.63,81.92 v50.63,87.63 v50.63,92.71
SPOKE33  (via drill 0.5)
  Top 0.254: LED161.C 49.16,81.71 v48.73,81.28 | LED33.C 48.91,92.89 v48.73,92.71 | LED97.C 49.04,87.94 v48.73,87.63
  Bottom 0.203: IC2.20 45.87,33.97 48.89,36.99 48.89,58.9 44.28,63.5 44.28,76.83 v48.73,81.28
  Bottom 0.254: v48.73,81.28 v48.73,87.63 v48.73,92.71
SPOKE34  (via drill 0.5)
  Top 0.254: v46.83,92.71 46.83,93.91 LED34.C | LED98.C 47.11,87.98 v47.46,87.63 | LED162.C 47.48,82.57 v47.46,82.55
  Bottom 0.203: IC2.19 45.87,34.6 48.41,37.15 48.41,58.1 43.65,62.87 43.65,77.47 47.46,81.28 v47.46,82.55
  Bottom 0.254: v47.46,82.55 v47.46,87.63 47.46,92.08 v46.83,92.71
SPOKE35  (via drill 0.5)
  Top 0.254: v44.92,92.08 44.58,92.41 LED35.C | LED99.C 45.2,87.99 v46.19,87 | LED163.C 45.81,82.93 v46.19,82.55
  Bottom 0.203: IC2.18 45.88,35.24 47.94,37.31 47.94,57.31 43.02,62.23 43.02,78.11 46.19,81.28 v46.19,82.55
  Bottom 0.254: v46.19,82.55 v46.19,87 46.19,90.81 v44.92,92.08
SPOKE36  (via drill 0.5)
  Top 0.254: v43.02,91.44 42.43,92.02 LED36.C | LED100.C 43.29,86.72 v43.65,86.36 | LED164.C 44.14,82.06 v44.28,81.92
  Bottom 0.203: IC2.17 45.88,35.88 47.46,37.47 47.46,56.52 42.38,61.59 42.38,78.74 44.28,80.64 v44.28,81.92
  Bottom 0.254: v44.28,81.92 44.28,85.72 v43.65,86.36 43.65,90.81 v43.02,91.44
SPOKE37  (via drill 0.5)
  Top 0.254: v40.48,90.81 40.48,91.79 LED37.C | LED101.C 41.4,86.07 v41.74,85.72 | LED165.C 42.5,81.16 v43.02,80.64
  Bottom 0.203: IC2.16 45.88,36.52 46.98,37.62 46.98,55.72 41.74,60.96 41.74,79.38 v43.02,80.64
  Bottom 0.254: v43.02,80.64 43.02,84.45 v41.74,85.72 41.74,89.53 v40.48,90.81
SPOKE38  (via drill 0.5)
  Top 0.254: v38.57,89.53 38.2,89.91 LED38.C | LED102.C 39.53,85.4 v40.16,84.77 | LED166.C 40.87,80.25 v41.11,80.01
  Bottom 0.203: IC2.15 45.89,37.16 46.51,37.78 46.51,54.93 41.11,60.33 v41.11,80.01
  Bottom 0.254: v41.11,80.01 41.11,83.82 v40.16,84.77 40.16,87.95 v38.57,89.53
SPOKE39  (via drill 0.5)
  Top 0.254: LED39.C 36.12,88.81 v36.66,88.27 | LED103.C 37.69,84.07 v38.25,83.5 | LED167.C 39.26,79.32 v39.84,78.74
  Bottom 0.203: IC2.14 45.89,37.8 46.03,37.94 46.03,54.13 39.84,60.33 v39.84,78.74
  Bottom 0.254: v39.84,78.74 39.84,81.92 v38.25,83.5 38.25,86.68 v36.66,88.27
SPOKE40  (via drill 0.5)
  Top 0.254: v34.12,86.36 34.08,86.41 LED40.C | LED104.C 36.03,83.11 v36.03,81.92 | LED168.C 37.67,77.73 v37.94,77.47
  Bottom 0.203: v37.94,77.47 37.94,60.96 44.92,53.98 44.92,38.51 IC2.13
  Bottom 0.254: v37.94,77.47 37.94,80.01 v36.03,81.92 36.03,84.45 v34.12,86.36
SPOKE41  (via drill 0.5)
  Top 0.254: v34.12,80.01 34.12,81.56 LED105.C | LED169.C 36.12,76.11 v36.66,75.56 | LED41.C 32.22,86.01 v32.22,84.77
  Bottom 0.203: IC2.12 39.78,57.84 36.66,60.96 v36.66,75.56
  Bottom 0.254: v36.66,75.56 34.12,78.11 v34.12,80.01 32.22,81.92 v32.22,84.77
SPOKE42  (via drill 0.5)
  Top 0.254: LED106.C 32.35,77.97 v32.86,77.47 | LED170.C 34.6,73.82 v35.39,73.03 | LED42.C 30.11,82.76 v30.32,82.55
  Bottom 0.203: IC2.11 38.87,37.8 38.73,37.94 38.73,57.63 35.39,60.96 v35.39,73.03
  Bottom 0.254: v35.39,73.03 35.39,74.93 v32.86,77.47 30.32,80.01 v30.32,82.55
SPOKE43  (via drill 0.5)
  Top 0.254: v30.95,76.2 30.65,76.5 LED107.C | LED171.C 33.12,72.13 v33.49,71.75 | LED43.C 28.19,80.87 v28.41,80.64
  Bottom 0.203: IC2.10 38.87,37.16 38.25,37.78 38.25,56.83 34.76,60.33 34.76,70.48 v33.49,71.75
  Bottom 0.254: v33.49,71.75 33.49,73.66 v30.95,76.2 28.41,78.74 v28.41,80.64
SPOKE44  (via drill 0.5)
  Top 0.254: v29.68,74.3 29.68,74.72 LED108.C | LED172.C 31.68,70.39 v33.49,68.58 | LED44.C 26.33,78.92 v27.14,78.11
  Bottom 0.203: IC2.9 38.88,36.52 37.78,37.62 37.78,56.04 33.49,60.33 v33.49,68.58
  Bottom 0.254: v33.49,68.58 33.49,70.48 v29.68,74.3 27.14,76.83 v27.14,78.11
SPOKE45  (via drill 0.5)
  Top 0.254: v32.22,66.67 32.22,66.94 LED173.C | LED109.C 27.4,72.77 v28.41,71.75 | LED45.C 24.52,76.28 v25.23,75.56
  Bottom 0.203: IC2.8 38.88,35.88 37.3,37.47 37.3,55.24 32.22,60.33 v32.22,66.67
  Bottom 0.254: v32.22,66.67 28.41,70.48 v28.41,71.75 25.23,74.93 v25.23,75.56
SPOKE46  (via drill 0.5)
  Top 0.254: v30.32,64.77 30.32,65.03 LED174.C | LED110.C 25.85,69.87 v26.5,69.22 | LED46.C 22.78,73.58 v23.33,73.03
  Bottom 0.203: IC2.7 38.88,35.24 36.82,37.31 36.82,54.45 31.59,59.69 31.59,63.5 v30.32,64.77
  Bottom 0.254: v30.32,64.77 26.5,68.58 v26.5,69.22 23.33,72.39 v23.33,73.03
SPOKE47  (via drill 0.5)
  Top 0.254: v30.32,60.96 30.32,61.11 LED175.C | LED111.C 24.36,67.55 v25.23,66.67 | LED47.C 21.18,71.37 v22.06,70.48
  Bottom 0.203: IC2.6 38.89,34.6 36.35,37.15 36.35,53.66 30.32,59.69 v30.32,60.96
  Bottom 0.254: v30.32,60.96 25.23,66.04 v25.23,66.67 22.06,69.85 v22.06,70.48
SPOKE48  (via drill 0.5)
  Top 0.254: v27.77,59.69 27.71,59.69 LED176.C | LED112.C 22.94,64.53 v23.96,63.5 | LED48.C 19.49,67.98 v20.16,67.31
  Bottom 0.203: IC2.5 38.89,33.97 35.87,36.99 35.87,52.86 29.05,59.69 v27.77,59.69
  Bottom 0.254: v27.77,59.69 v23.96,63.5 v20.16,67.31
SPOKE49  (via drill 0.5)
  Top 0.254: v25.87,57.15 25.87,57.42 LED177.C | LED113.C 21.57,61.45 v22.7,60.33 | LED49.C 18.03,64.99 v18.89,64.14
  Bottom 0.203: IC1.20 31.91,32.71 32.86,33.66 32.86,50.16 v25.87,57.15
  Bottom 0.254: v25.87,57.15 v22.7,60.33 v18.89,64.14
SPOKE50  (via drill 0.5)
  Top 0.254: v25.23,53.98 25.12,53.98 LED178.C | LED114.C | v21.43,57.15 LED114.C | LED50.C 16.49,61.45 v17.62,60.33
  Bottom 0.203: IC1.19 31.27,32.7 32.22,33.66 32.22,46.99 v25.23,53.98
  Bottom 0.254: v25.23,53.98 22.06,57.15 v21.43,57.15 18.25,60.33 v17.62,60.33
SPOKE51  (via drill 0.5)
  Top 0.254: v24.28,51.12 23.71,51.12 LED179.C | LED115.C 19.22,54.91 v20.16,53.98 | LED51.C 15.51,57.98 v16.34,57.15
  Bottom 0.203: IC1.18 30.63,32.7 31.59,33.66 31.59,43.81 v24.28,51.12
  Bottom 0.254: v24.28,51.12 21.43,53.98 v20.16,53.98 16.98,57.15 v16.34,57.15
SPOKE52  (via drill 0.5)
  Top 0.254: LED180.C 23.08,48.51 v23.33,48.26 | LED116.C 18.3,51.39 v18.89,50.8 | LED52.C 14.78,54.27 v15.08,53.98
  Bottom 0.203: IC1.17 29.99,32.7 30.95,33.66 30.95,40.64 v23.33,48.26
  Bottom 0.254: v23.33,48.26 20.79,50.8 v18.89,50.8 15.71,53.98 v15.08,53.98
SPOKE53  (via drill 0.5)
  Top 0.254: v22.06,44.45 21.69,44.45 LED181.C | LED117.C 16.86,47.75 v17.62,46.99 | LED53.C 12.91,50.42 v13.8,49.53
  Bottom 0.203: IC1.16 29.35,32.69 30.32,33.66 30.32,37.47 23.33,44.45 v22.06,44.45
  Bottom 0.254: v22.06,44.45 19.52,46.99 v17.62,46.99 15.08,49.53 v13.8,49.53
SPOKE54  (via drill 0.5)
  Top 0.254: v21.43,40.64 20.54,41.53 LED182.C | LED118.C 16.17,43.99 v16.98,43.18 | LED54.C 11.8,46.46 v12.53,45.72
  Bottom 0.203: IC1.15 28.71,32.69 29.68,33.66 29.68,37.47 26.5,40.64 v21.43,40.64
  Bottom 0.254: v21.43,40.64 18.89,43.18 v16.98,43.18 14.44,45.72 v12.53,45.72
SPOKE55  (via drill 0.5)
  Top 0.254: LED119.C 15.59,40.13 v16.34,39.37 | LED55.C 11.43,42.38 v11.9,41.91 | v19.84,36.51 19.84,37.45 LED183.C
  Bottom 0.203: IC1.14 28.07,30.18 27.93,30.32 23.49,30.32 20.16,33.66 20.16,36.2 v19.84,36.51
  Bottom 0.254: v19.84,36.51 19.84,39.37 v16.34,39.37 13.8,41.91 v11.9,41.91
SPOKE56  (via drill 0.5)
  Top 0.254: LED120.C 14.47,36.17 v15.08,35.56 | LED56.C 9.9,38.19 v10.63,37.47 | v19.52,33.02 19.52,33.66 19.03,34.14 LED184.C
  Bottom 0.203: IC1.13 23.27,29.27 v19.52,33.02
  Bottom 0.254: v19.52,33.02 19.52,35.56 v15.08,35.56 13.17,37.47 v10.63,37.47
SPOKE57  (via drill 0.5)
  Top 0.254: LED185.C 18.05,30.05 18.25,29.84 v19.52,29.84 | LED57.C 9.73,33.92 v9.99,33.66 | LED121.C 14.07,32.12 v14.44,31.75
  Bottom 0.203: IC1.12 25.93,24.07 20.16,29.84 v19.52,29.84
  Bottom 0.254: v19.52,29.84 17.62,31.75 v14.44,31.75 12.53,33.66 v9.99,33.66
SPOKE58  (via drill 0.5)
  Top 0.254: v20.16,26.67 17.72,26.67 LED186.C | LED58.C 9.01,29.56 v9.36,29.21 | LED122.C 13.11,28 v13.8,27.3
  Bottom 0.203: IC1.11 28.07,23.16 27.93,23.02 25.71,23.02 22.06,26.67 v20.16,26.67
  Bottom 0.254: v20.16,26.67 19.52,27.3 v13.8,27.3 11.9,29.21 v9.36,29.21
SPOKE59  (via drill 0.5)
  Top 0.254: LED187.C 17.23,22.47 v19.52,24.77 | LED59.C 8.35,25.14 v8.73,24.77 | LED123.C 13.18,23.8 v13.49,23.5
  Bottom 0.203: IC1.10 28.71,23.16 28.09,22.54 24.92,22.54 22.7,24.77 v19.52,24.77
  Bottom 0.254: v19.52,24.77 18.25,23.5 v13.49,23.5 12.22,24.77 v8.73,24.77
SPOKE60  (via drill 0.5)
  Top 0.254: LED188.C 17.66,18.46 v18.25,19.05 | LED124.C 12.67,19.55 v13.17,19.05 | LED60.C 7.76,20.65 v8.09,20.32
  Bottom 0.203: IC1.9 29.35,23.16 28.25,22.07 21.27,22.07 v18.25,19.05
  Bottom 0.254: v8.09,20.32 11.9,20.32 v13.17,19.05 v18.25,19.05
SPOKE61  (via drill 0.5)
  Top 0.254: LED189.C 18.05,14.4 v19.52,15.88 | LED61.C 7.22,16.11 v7.45,15.88 | LED125.C 12.52,15.26 v12.53,15.24
  Bottom 0.203: IC1.8 29.99,23.17 28.41,21.59 22.06,21.59 19.2,18.73 19.2,16.51 19.2,16.19 v19.52,15.88
  Bottom 0.254: v7.45,15.88 11.9,15.88 v12.53,15.24 18.89,15.24 v19.52,15.88
SPOKE62  (via drill 0.5)
  Top 0.254: LED126.C 12.4,10.93 v12.53,10.79 | LED62.C 7.35,11.54 v7.45,11.43 | LED190.C 17.13,10.31 v17.62,10.79
  Bottom 0.203: IC1.7 30.63,23.18 28.57,21.11 22.85,21.11 21.74,20 21.74,14.92 v17.62,10.79
  Bottom 0.254: v7.45,11.43 11.9,11.43 v12.53,10.79 v17.62,10.79
SPOKE63  (via drill 0.5)
  Top 0.203: v22.7,18.41 v20.79,18.41
  Top 0.254: LED63.C 7.4,6.93 v7.45,6.99 | LED127.C 12.32,6.57 v12.53,6.35 | LED191.C 16.83,6.2 v16.98,6.35
  Bottom 0.203: IC1.6 31.27,23.18 28.73,20.64 24.92,20.64 v22.7,18.41 | v7.45,6.99 2.69,6.99 2.06,7.62 2.06,13.02 2.69,13.65 19.84,13.65 21.11,14.92 21.11,18.1 v20.79,18.41
  Bottom 0.254: v16.98,6.35 v12.53,6.35 11.9,6.99 v7.45,6.99
SPOKE64  (via drill 0.5)
  Top 0.203: v22.7,17.14 v20.16,17.14
  Top 0.254: LED64.C 6.41,2.31 v6.82,1.91 | LED128.C 11.62,2.19 v11.9,1.91 | LED192.C 16.82,2.07 v16.98,1.91
  Bottom 0.203: IC1.5 31.91,23.18 28.89,20.16 26.03,20.16 23.01,17.14 v22.7,17.14 | v20.16,17.14 20.47,16.83 20.47,14.92 19.84,14.29 2.38,14.29 1.58,13.34 1.58,5.24 4.91,1.91 v6.82,1.91
  Bottom 0.254: v16.98,1.91 v11.9,1.91 v6.82,1.91